# Altium schematic sheet 36Pin_SuperSeal_Conn.SchDoc
size A
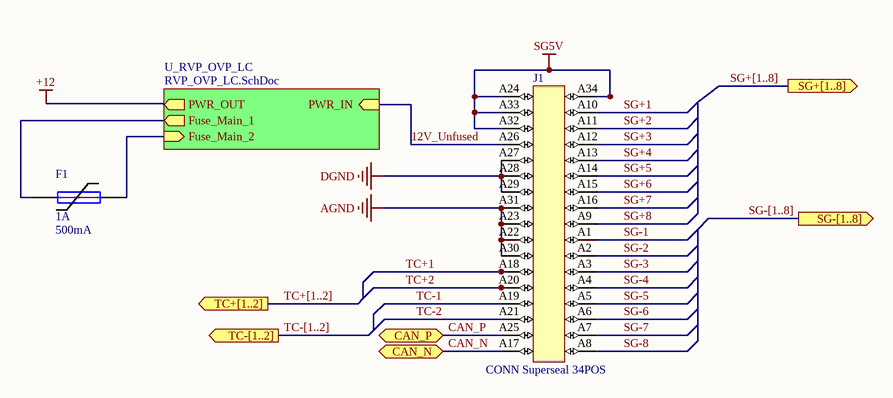
[diagram p0: 36Pin_SuperSeal_Conn.SchDoc]

## Parts
F1  1A  I_hold: 500mA  [PTC Fuse 1206/3216]
J1  CONN Superseal 34POS  [Superseal 34POS]

## Sub-sheets
U_RVP_OVP_LC = RVP_OVP_LC.SchDoc: PWR_IN (in), PWR_OUT (out), Fuse_Main_2 (in), Fuse_Main_1 (out)

## Ports
CAN_N (bidir), CAN_P (bidir), SG+[1..8] (out), SG-[1..8] (out), TC+[1..2] (out), TC-[1..2] (out)

## Nets
+12: sheet U_RVP_OVP_LC/PWR_OUT
AGND: J1.A22 J1.A23 J1.A30 J1.A31
DGND: J1.A27 J1.A28 J1.A29
SG5V: J1.A24 J1.A32 J1.A33 J1.A34
12V_Unfused: J1.A26 ; sheet U_RVP_OVP_LC/PWR_IN
CAN_N: J1.A17 ; port CAN_N
CAN_P: J1.A25 ; port CAN_P
SG+1: J1.A10
SG+2: J1.A11
SG+3: J1.A12
SG+4: J1.A13
SG+5: J1.A14
SG+6: J1.A15
SG+7: J1.A16
SG+8: J1.A9
SG-1: J1.A1
SG-2: J1.A2
SG-3: J1.A3
SG-4: J1.A4
SG-5: J1.A5
SG-6: J1.A6
SG-7: J1.A7
SG-8: J1.A8
TC+1: J1.A18
TC+2: J1.A20
TC-1: J1.A19
TC-2: J1.A21
NetF1_1: F1.1 ; sheet U_RVP_OVP_LC/Fuse_Main_1
NetF1_2: F1.2 ; sheet U_RVP_OVP_LC/Fuse_Main_2

## Buses and harness runs
bus SG+[1..8] = port SG+[1..8]
bus SG-[1..8] = port SG-[1..8]
bus TC+[1..2] = port TC+[1..2]
bus TC-[1..2] = port TC-[1..2]

## Library data of the parts
F1 = 5: Fuse; Manufacturer_id: 1; MfrPartNo: 1206L050/15YR; idFuse: 5; Name: PTC Poly Fuse Resettable; I_max: 100A; V_max: 15V; Pd_Typ: 600mW; Created_By: Angel; Published: 8-Jun-2000; LatestRevisionDate: 17-Jul-2002; LatestRevisionNote: Re-released for DXP Platform.; PackageReference: PIN-W2/E2.8; Publisher: Altium Limited; PackageDescription: Thru-Hole; 2 Leads; Drawer_id: 1; I_trip: 1A; Link: https://www.digikey.com/product-detail/en/littelfuse-inc/1206L050-15YR/F3733CT-ND/2486168; Created_Date: 10/27/2018
J1 = 11: Connector Header Through Hole, Right Angle 34 position 0.118" (3.00mm); Manufacturer_id: 5; MfrPartNo: 6437288-1; idConn: 11; Drawer_id: 1; Name: AMP Superseal 34 POS; Voltage_Rating: 250VDC; Num_Contacts: 34; Num_Rows: 4; Pitch: 3mm; Value: CONN; Link: https://www.digikey.com/products/en?mpart=6437288-1&&csp=WT.z_cid%3Dsp_8004_20120425_buynow%26TE_cid%3D8004-1541898693362; ComponentLink1Description: Datasheet; ComponentLink1URL: https://www.te.com/commerce/DocumentDelivery/DDEController?Action=srchrtrv&DocNm=6437288-1&DocType=Customer+Drawing&DocLang=Japanese; Supplier1: Digi-Key; Supplier1PartNo: A124384-ND